# EAGLE design PicKit2-v1.2 (EAGLE 7.2.0)
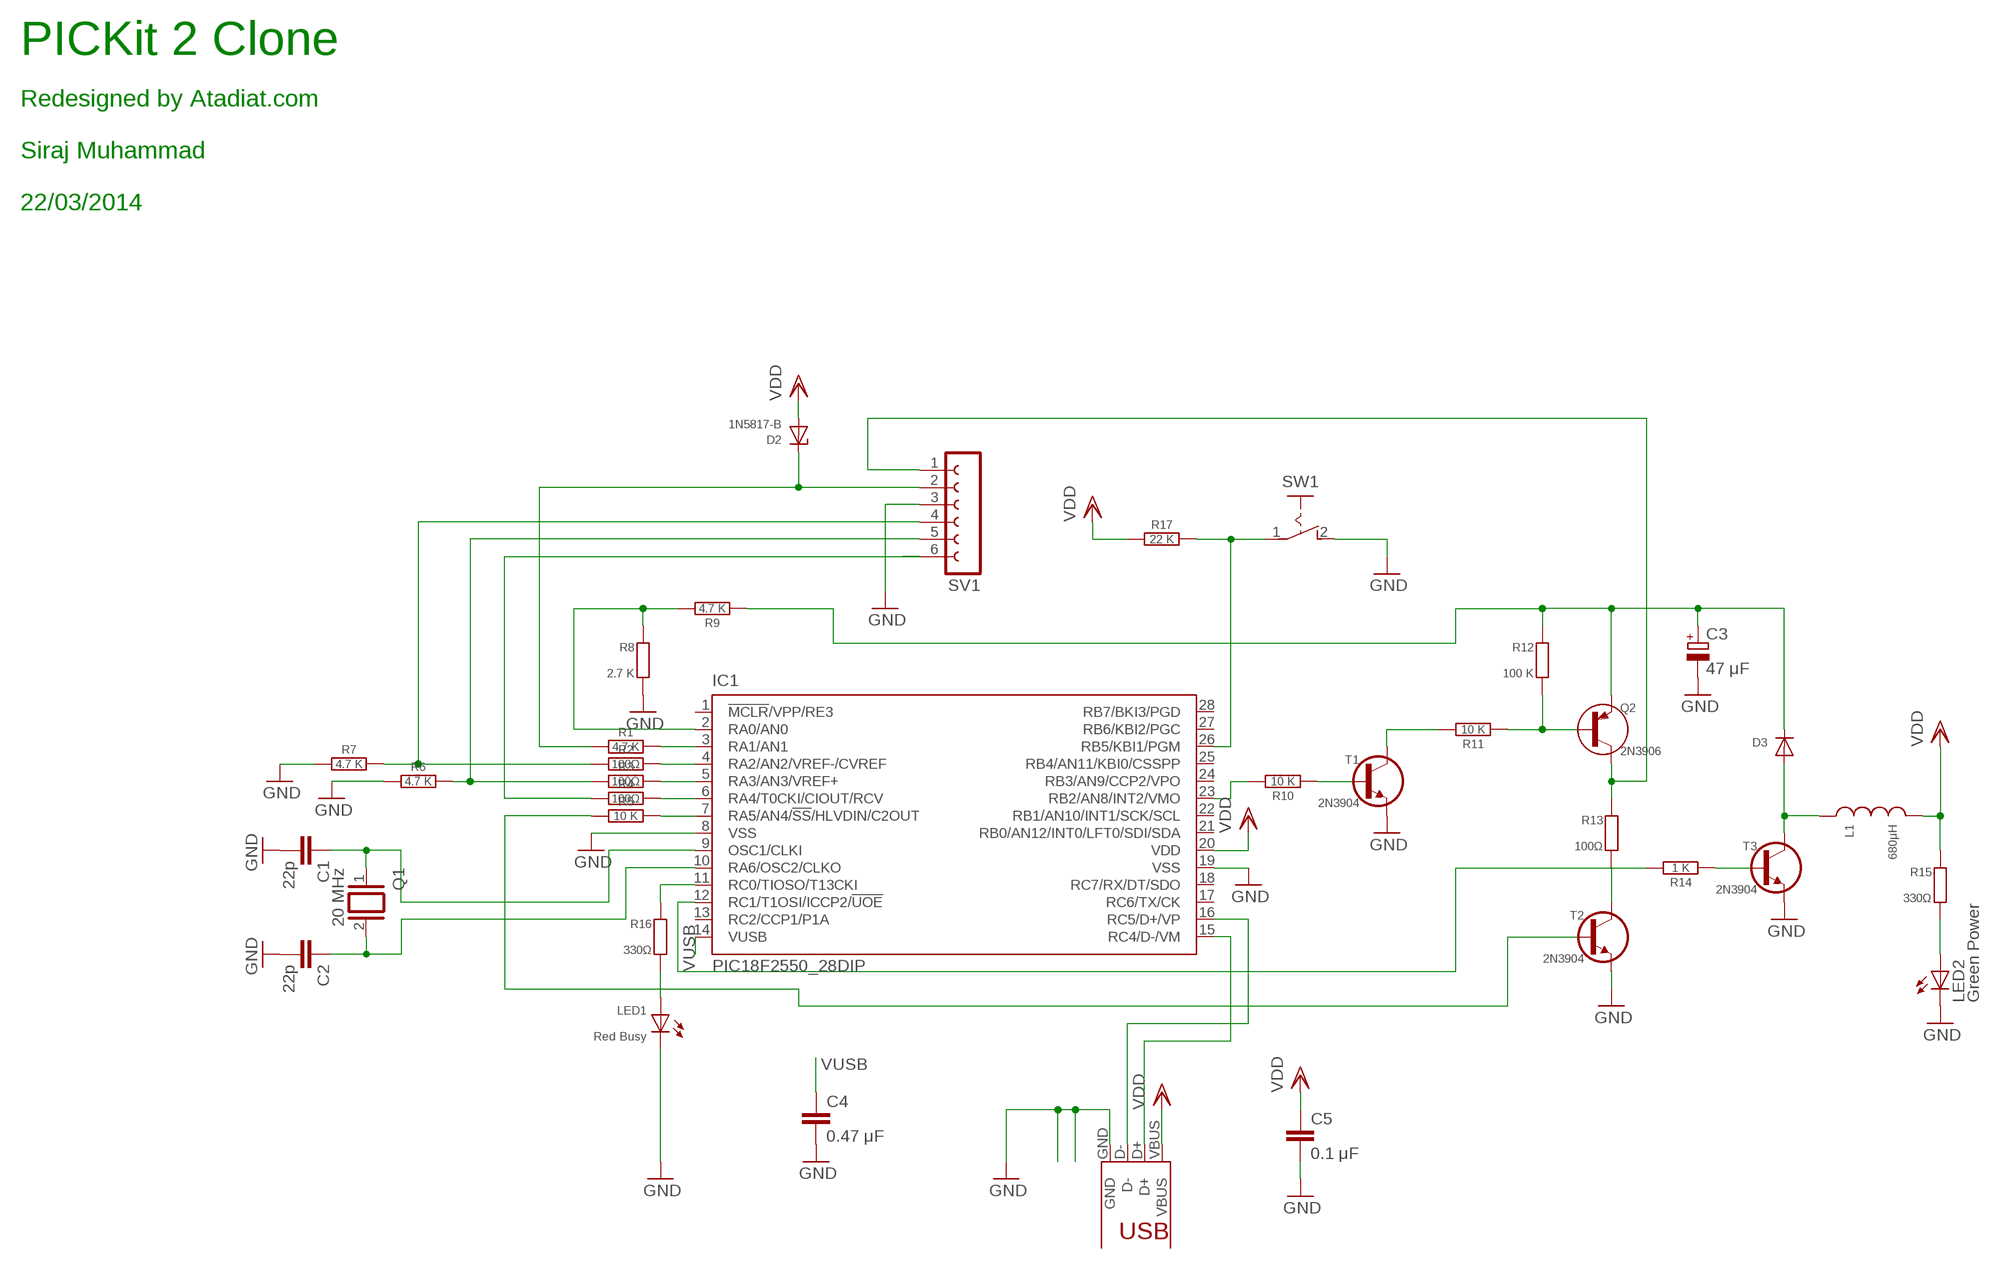
[diagram p0: schematic, sheet 1]

## Parts
C1  22p  C025-020X036  [C025-020X036]
C2  22p  C025-020X036  [C025-020X036]
C3  47 μF  CPOL-EUE2,5-6E  [E2,5-6E]
C4  0.47 μF  C050-030X075  [C050-030X075]
C5  0.1 μF  C050-024X044  [C050-024X044]
D2  1N5817-B  Z-DIODE34Z10  [DO34Z10]
D3  DIODE34-10  [DO34-10]
IC1  PIC18F2550_28DIP  [DIL28-3]
J1  USB-PRINT  [USB-B-PRINT]
L1  680μH  L-09R  [L-8R]
LED1  Red Busy  LED-3MM  [LED_3MM]
LED2  Green Power  LED3MM  [LED3MM]
Q1  20 MHz  XTAL/S  [QS]
Q2  2N3906  [TO92]
R1  4.7 K  R-H0204/10  [0204/10]
R2  100Ω  R-H0204/10  [0204/10]
R3  100Ω  R-H0204/10  [0204/10]
R4  100Ω  R-H0204/10  [0204/10]
R5  10 K  R-H0204/10  [0204/10]
R6  4.7 K  R-H0204/10  [0204/10]
R7  4.7 K  R-H0204/10  [0204/10]
R8  2.7 K  R0204/10  [0204/10]
R9  4.7 K  R-H0204/10  [0204/10]
R10  10 K  R-H0204/10  [0204/10]
R11  10 K  R-H0204/10  [0204/10]
R12  100 K  R0204/10  [0204/10]
R13  100Ω  R0204/10  [0204/10]
R14  1 K  R-H0204/10  [0204/10]
R15  330Ω  R0204/10  [0204/10]
R16  330Ω  R0204/10  [0204/10]
R17  22 K  R-H0204/10  [0204/10]
SV1  FE06-1  [FE06]
SW1  PB-1P-1T  [PB-1P1T]
T1  2N3904  [TO92]
T2  2N3904  [TO92]
T3  2N3904  [TO92]

## Nets
GND: C1.2 C2.2 C3.- C4.2 C5.2 IC1.8(VSS) IC1.19(VSS) J1.GND LED1.K(C) LED2.K(C) R6.1 R7.1 R8.2 SV1.3 SW1.2(S) T1.1(E) T2.1(E) T3.1(E)
N$1: C1.1 IC1.9(OSC1/CLKI) Q1.1
N$2: C2.1 IC1.10(RA6/OSC2/CLKO) Q1.2
N$3: IC1.3(RA1/AN1) R1.2
N$4: IC1.4(RA2/AN2/VREF-/CVREF) R2.2
N$5: IC1.5(RA3/AN3/VREF+) R3.2
N$6: IC1.6(RA4/T0CKI/CIOUT/RCV) R4.2
N$7: IC1.7(RA5/AN4/!SS!/HLVDIN/C2OUT) R5.2
N$8: D2.C R1.1 SV1.2
N$9: R2.1 R7.2 SV1.4
N$10: R3.1 R6.2 SV1.5
N$11: R4.1 SV1.6
N$12: IC1.2(RA0/AN0) R8.1 R9.2
N$13: IC1.23(RB2/AN8/INT2/VMO) R10.2
N$14: R10.1 T1.2(B)
N$15: R11.2 T1.3(C)
N$16: Q2.2(B) R11.1 R12.2
N$17: C3.+ D3.C Q2.1(E) R9.1 R12.1
N$18: IC1.12(RC1/T1OSI/ICCP2/!UOE) R14.2
N$19: R5.1 T2.2(B)
N$20: Q2.3(C) R13.1 SV1.1
N$21: R13.2 T2.3(C)
N$22: R14.1 T3.2(B)
N$23: D3.A L1.P$1 T3.3(C)
N$25: LED2.A R15.2
N$26: IC1.11(RC0/TIOSO/T13CKI) R16.1
N$27: LED1.A R16.2
N$28: IC1.16(RC5/D+/VP) J1.D-
N$29: IC1.15(RC4/D-/VM) J1.D+
N$31: IC1.26(RB5/KBI1/PGM) R17.2 SW1.1(P)
VDD: C5.1 D2.A IC1.20(VDD) J1.VBUS L1.P$2 R15.1 R17.1
VUSB: C4.1 IC1.14(VUSB)
Unconnected: IC1.1(!MCLR!/VPP/RE3) IC1.13(RC2/CCP1/P1A) IC1.17(RC6/TX/CK) IC1.18(RC7/RX/DT/SDO) IC1.21(RB0/AN12/INT0/LFT0/SDI/SDA) IC1.22(RB1/AN10/INT1/SCK/SCL) IC1.24(RB3/AN9/CCP2/VPO) IC1.25(RB4/AN11/KBI0/CSSPP) IC1.27(RB6/KBI2/PGC) IC1.28(RB7/BKI3/PGD)

## Notes on the sheet
- PICKit 2 Clone
- Redesigned by Atadiat.com
- Siraj Muhammad
- 22/03/2014

## Library data of the parts
C1 C2 C4 C5 = c:C: CAPACITOR, European symbol
C3 = rcl:CPOL-EU: POLARIZED CAPACITOR, European symbol
D2 = d:Z-DIODE
D3 = d:DIODE
IC1 = microchip:PIC18F2*_28: USB Microcontrollers with nanoWatt Technology High-Performance, Enhanced Flash, 28/40/44-Pin, Source: http://ww1.microchip.com/downloads/en/devicedoc/39632c.pdf; MF: MICROCHIP; MPN: PIC18F2550-I/SP; OC_FARNELL: 1523822; OC_NEWARK: 80K6054
J1 = usb:USB: USB Connectors USB-B-PTH is fully proven SKU : PRT-00139 USB-miniB is fully proven SKU : PRT-00587 USB-A-PCB is untested. USB-A-H is throughly reviewed, but untested. Spark Fun Electronics SKU : PRT-00437 USB-B-SMT is throughly reviewed, but untested. Needs silkscreen touching up. USB-A-S has not been used/tested USB-MB-H has not been used/tested
L1 = l:L: Potentiometers Beckman, Copal, Piher, Spectrol, Schukat Created by librarian@cadsoft.de
LED1 = d:LED
LED2 = led:LED: LED OSRAM: - CHIPLED LG R971, LG N971, LY N971, LG Q971, LY Q971, LO R971, LY R971 LH N974, LH R974 LS Q976, LO Q976, LY Q976 LO Q996 - Hyper CHIPLED LW Q18S LB Q993, LB Q99A, LB R99A - SideLED LS A670, LO A670, LY A670, LG A670, LP A670 LB A673, LV A673, LT A673, LW A673 LH A674 LY A675 LS A676, LA A676, LO A676, LY A676, LW A676 LS A679, LY A679, LG A679 - Hyper Micro SIDELED® LS Y876, LA Y876, LO Y876, LY Y876 LT Y87S - SmartLED LW L88C, LW L88S LB L89C, LB L89S, LG L890 LS L89K, LO L89K, LY L89K LS L896, LA L896, LO L896, LY L896 - TOPLED LS T670, LO T670, LY T670, LG T670, LP T670 LSG T670, LSP T670, LSY T670, LOP T670, LYG T670 LG T671, LOG T671, LSG T671 LB T673, LV T673, LT T673, LW T673 LH T674 LS T676, LA T676, LO T676, LY T676, LB T676, LH T676, LSB T676, LW T676 LB T67C, LV T67C, LT T67C, LS T67K, LO T67K, LY T67K, LW E67C LS E67B, LA E67B, LO E67B, LY E67B, LB E67C, LV E67C, LT E67C LW T67C LS T679, LY T679, LG T679 LS T770, LO T770, LY T770, LG T770, LP T770 LB T773, LV T773, LT T773, LW T773 LH T774 LS E675, LA E675, LY E675, LS T675 LS T776, LA T776, LO T776, LY T776, LB T776 LHGB T686 LT T68C, LB T68C - Hyper Mini TOPLED® LB M676 - Mini TOPLED Santana® LG M470 LS M47K, LO M47K, LY M47K Source: http://www.osram.convergy.de LUXEON: - LUMILED® LXK2-PW12-R00, LXK2-PW12-S00, LXK2-PW14-U00, LXK2-PW14-V00 LXK2-PM12-R00, LXK2-PM12-S00, LXK2-PM14-U00 LXK2-PE12-Q00, LXK2-PE12-R00, LXK2-PE12-S00, LXK2-PE14-T00, LXK2-PE14-U00 LXK2-PB12-K00, LXK2-PB12-L00, LXK2-PB12-M00, LXK2-PB14-N00, LXK2-PB14-P00, LXK2-PB14-Q00 LXK2-PR12-L00, LXK2-PR12-M00, LXK2-PR14-Q00, LXK2-PR14-R00 LXK2-PD12-Q00, LXK2-PD12-R00, LXK2-PD12-S00 LXK2-PH12-R00, LXK2-PH12-S00 LXK2-PL12-P00, LXK2-PL12-Q00, LXK2-PL12-R00 Source: www.luxeon.com KINGBRIGHT: KA-3528ASYC Source: www.kingbright.com
Q1 = special:XTAL/S: CRYSTAL
Q2 = t:2N3906
R1-R7 R9-R11 R14 R17 = r:R-H
R8 R12 R13 R15 R16 = r:R: RESISTOR, European symbol
SV1 = con-lsta:FE06-1: FEMALE HEADER; OC_FARNELL: unknown; OC_NEWARK: unknown
SW1 = sw:PB-1P-1T
T1-T3 = t:2N3904

## Board
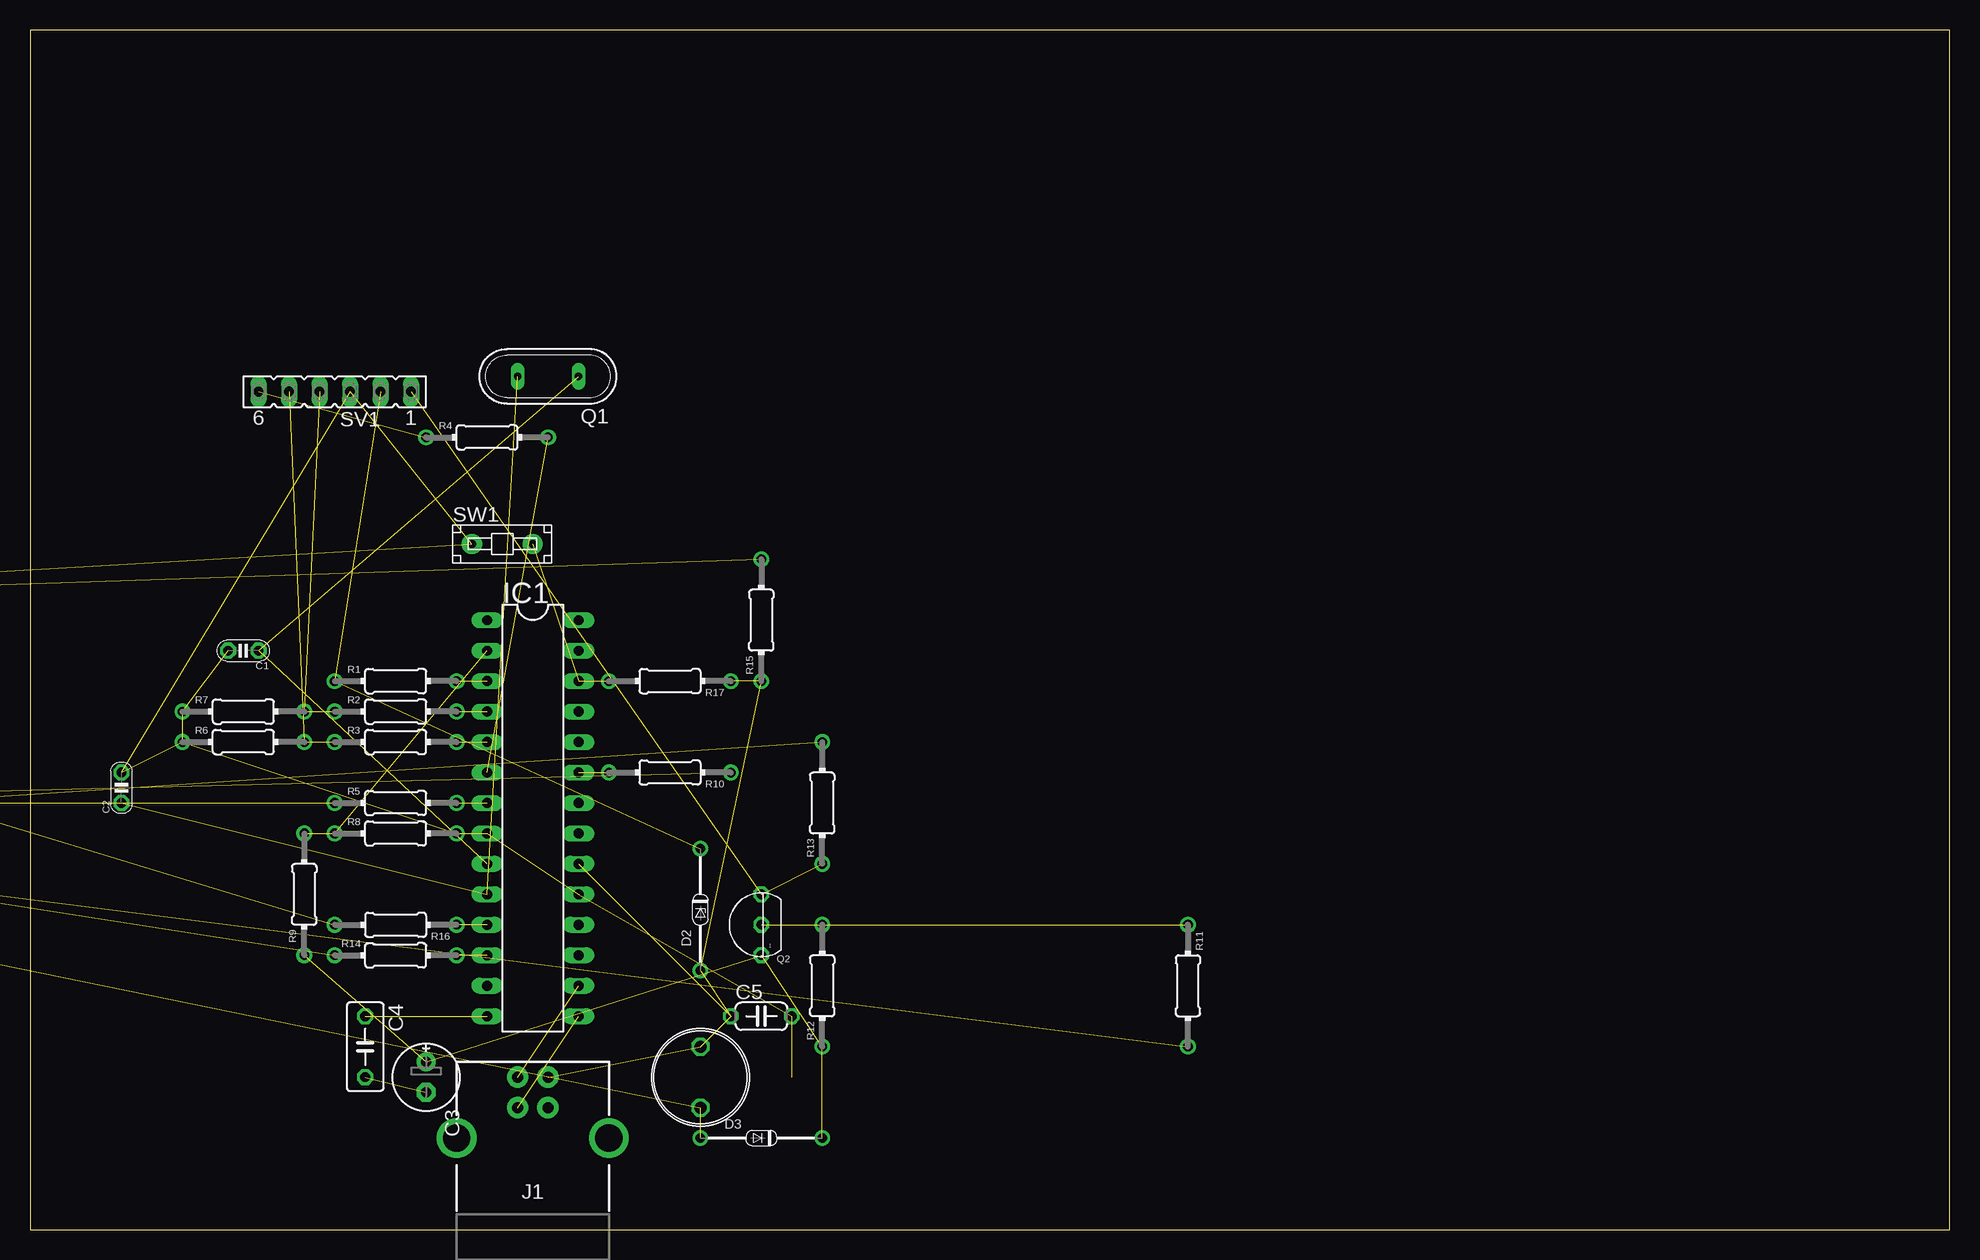
[diagram p1: board, top side]
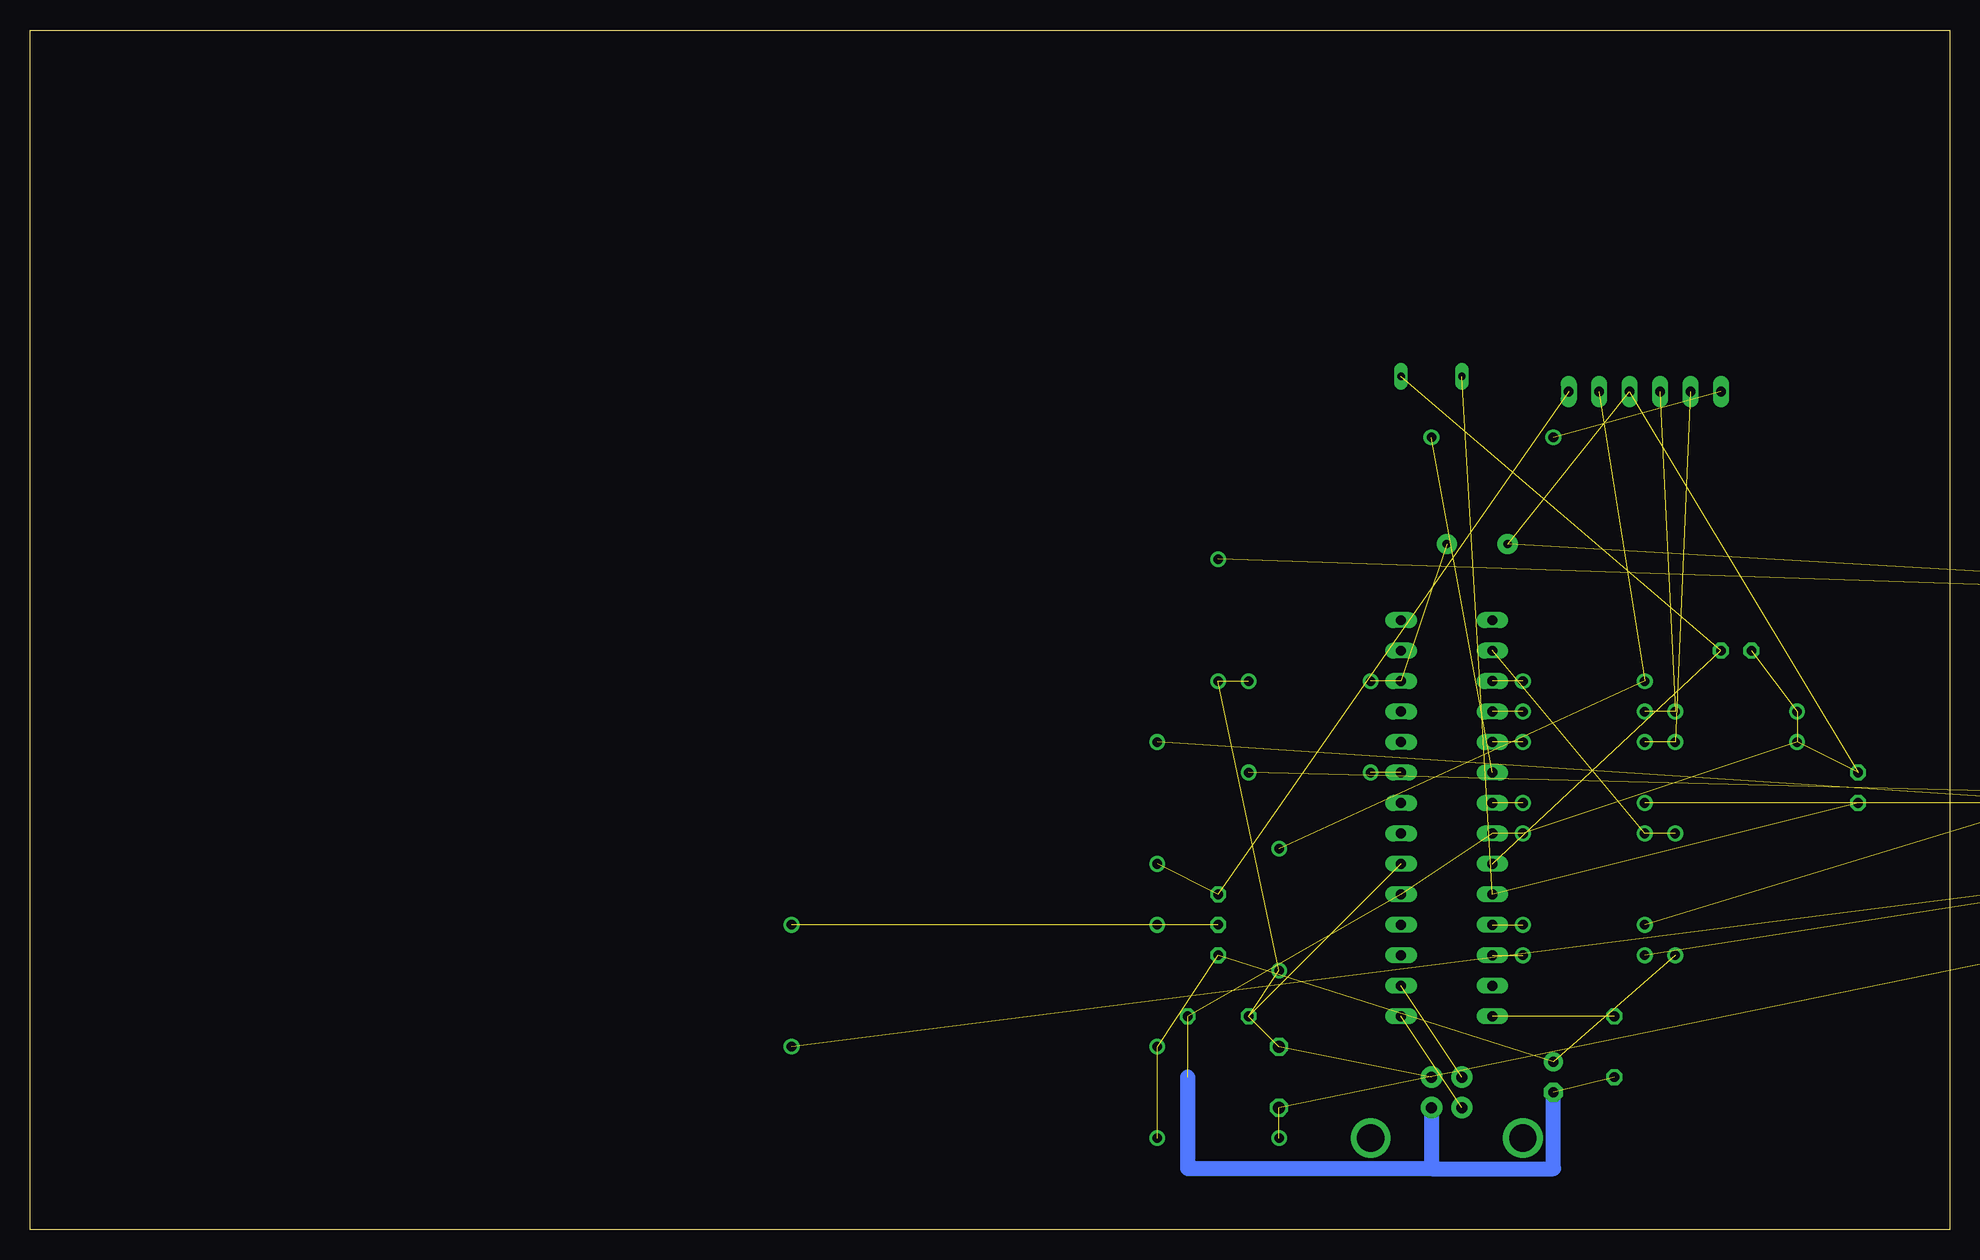
[diagram p2: board, bottom side, seen from below]

Size 160 x 100 mm. Coordinates in mm from the lower left corner, seen from the top.
Outline: 0,0 160,0 160,100 0,100 0,0
Copper layers (1*16): Top 0.035mm / dielectric 1.5mm / Bottom 0.035mm
Design rules "default": minimum track width 10mil, minimum drill 24mil, track to track 8mil, track to pad 8mil, pad to pad 8mil, via to via 8mil, smd to smd 8mil, copper to edge 40mil, drill to drill 8mil, minimum pad ring 10mil, minimum via ring 8mil, stop-mask expansion 4mil, vias tented up to drill 0mil, thermal gap 10mil

### Footprints (pad centres in the part's own frame; a part is rotated, then mirrored left to right if it is on the bottom)
C025-020X036 = drill 0.813 octagon: 1 0,0; 2 2.54,0
E2,5-6E = drill 0.813 pad 1.575: + -1.27,0 | drill 0.813 pad 1.575 octagon: - 1.27,0
C050-030X075 = drill 0.813 octagon: 1 -2.54,0; 2 2.54,0
C050-024X044 = drill 0.813 octagon: 1 -2.54,0; 2 2.54,0
DO34Z10 = drill 0.8: A -5.08,0; C 5.08,0
DO34-10 = drill 0.8: A 5.08,0; C -5.08,0
DIL28-3 = drill 0.813 long: 1 -16.51,-3.81; 2 -13.97,-3.81; 3 -11.43,-3.81; 4 -8.89,-3.81; 5 -6.35,-3.81; 6 -3.81,-3.81; 7 -1.27,-3.81; 8 1.27,-3.81; 9 3.81,-3.81; 10 6.35,-3.81; 11 8.89,-3.81; 12 11.43,-3.81; 13 13.97,-3.81; 14 16.51,-3.81; 15 16.51,3.81; 16 13.97,3.81; 17 11.43,3.81; 18 8.89,3.81; 19 6.35,3.81; 20 3.81,3.81; 21 1.27,3.81; 22 -1.27,3.81; 23 -3.81,3.81; 24 -6.35,3.81; 25 -8.89,3.81; 26 -11.43,3.81; 27 -13.97,3.81; 28 -16.51,3.81
USB-B-PRINT = drill 0.914 pad 1.778: D+ 2.54,0; D- 5.08,0; GND 2.54,-2.54; VBUS 5.08,-2.54 | drill 2.286: P$1 0,-7.62; P$2 0,5.08
L-8R = drill 1 octagon: P$1 -2.54,0; P$2 2.54,0
LED_3MM = drill 0.813 octagon: A -1.27,0; K 1.27,0
LED3MM = drill 0.813 octagon: A -1.27,0; K 1.27,0
QS = drill 0.61 long: 1 -2.54,0; 2 2.54,0
TO92 = drill 0.8 octagon: 1 0,2.54; 2 0,0; 3 0,-2.54
0204/10 = drill 0.8: 1 -5.08,0; 2 5.08,0
FE06 = drill 0.813 long: 1 -6.35,0; 2 -3.81,0; 3 -1.27,0; 4 1.27,0; 5 3.81,0; 6 6.35,0
PB-1P1T = drill 0.7 pad 1.676: 1 2.54,0; 2 -2.54,0

### Placement (x,y rotation side)
C1  19.05,48.26 180 top
C2  7.62,35.56 90 top
C3  33.02,12.7 270 top
C4  27.94,15.24 270 top
C5  60.96,17.78 0 top
D2  55.88,26.67 90 top
D3  60.96,7.62 180 top
IC1  41.91,34.29 270 top
J1  40.64,7.62 90 top
L1  55.88,12.7 90 top
LED1  -60.96,52.07 0 top  (outside the outline)
LED2  -52.07,52.07 0 top  (outside the outline)
Q1  43.18,71.12 180 top
Q2  60.96,25.4 180 top
R1  4.7kΩ  [0204/10]  30.48,45.72 0 top
R2  30.48,43.18 0 top
R3  30.48,40.64 0 top
R4  38.1,66.04 0 top
R5  10kΩ  [0204/10]  30.48,35.56 0 top
R6  4.7kΩ  [0204/10]  17.78,40.64 0 top
R7  4.7kΩ  [0204/10]  17.78,43.18 0 top
R8  2.7kΩ  [0204/10]  30.48,33.02 0 top
R9  4.7kΩ  [0204/10]  22.86,27.94 90 top
R10  10kΩ  [0204/10]  53.34,38.1 180 top
R11  10kΩ  [0204/10]  96.52,20.32 270 top
R12  100kΩ  [0204/10]  66.04,20.32 90 top
R13  66.04,35.56 90 top
R14  1kΩ  [0204/10]  30.48,22.86 0 top
R15  60.96,50.8 90 top
R16  30.48,25.4 180 top
R17  22kΩ  [0204/10]  53.34,45.72 180 top
SV1  25.4,69.85 180 top
SW1  39.37,57.15 0 top
T1  -43.18,35.56 0 top  (outside the outline)
T2  -49.53,35.56 0 top  (outside the outline)
T3  -55.88,35.56 0 top  (outside the outline)

### Tracks (layer width: path | path; a pad name or v marks a point on that pad's centre or on a via)
GND  (16 unrouted)
  Bottom 1.27: 43.18,5.08 33.02,5.08 C3.- | J1.GND 43.18,5.08 | 43.18,5.08 63.5,5.08 63.5,12.7
N$1  (2 unrouted)
N$2  (2 unrouted)
N$3  (1 unrouted)
N$4  (1 unrouted)
N$5  (1 unrouted)
N$6  (1 unrouted)
N$7  (1 unrouted)
N$8  (2 unrouted)
N$9  (2 unrouted)
N$10  (2 unrouted)
N$11  (1 unrouted)
N$12  (2 unrouted)
N$13  (1 unrouted)
N$14  (1 unrouted)
N$15  (1 unrouted)
N$16  (2 unrouted)
N$17  (4 unrouted)
N$18  (1 unrouted)
N$19  (1 unrouted)
N$20  (2 unrouted)
N$21  (1 unrouted)
N$22  (1 unrouted)
N$23  (2 unrouted)
N$25  (1 unrouted)
N$26  (1 unrouted)
N$27  (1 unrouted)
N$28  (1 unrouted)
N$29  (1 unrouted)
N$31  (2 unrouted)
VDD  (6 unrouted)
VUSB  (1 unrouted)